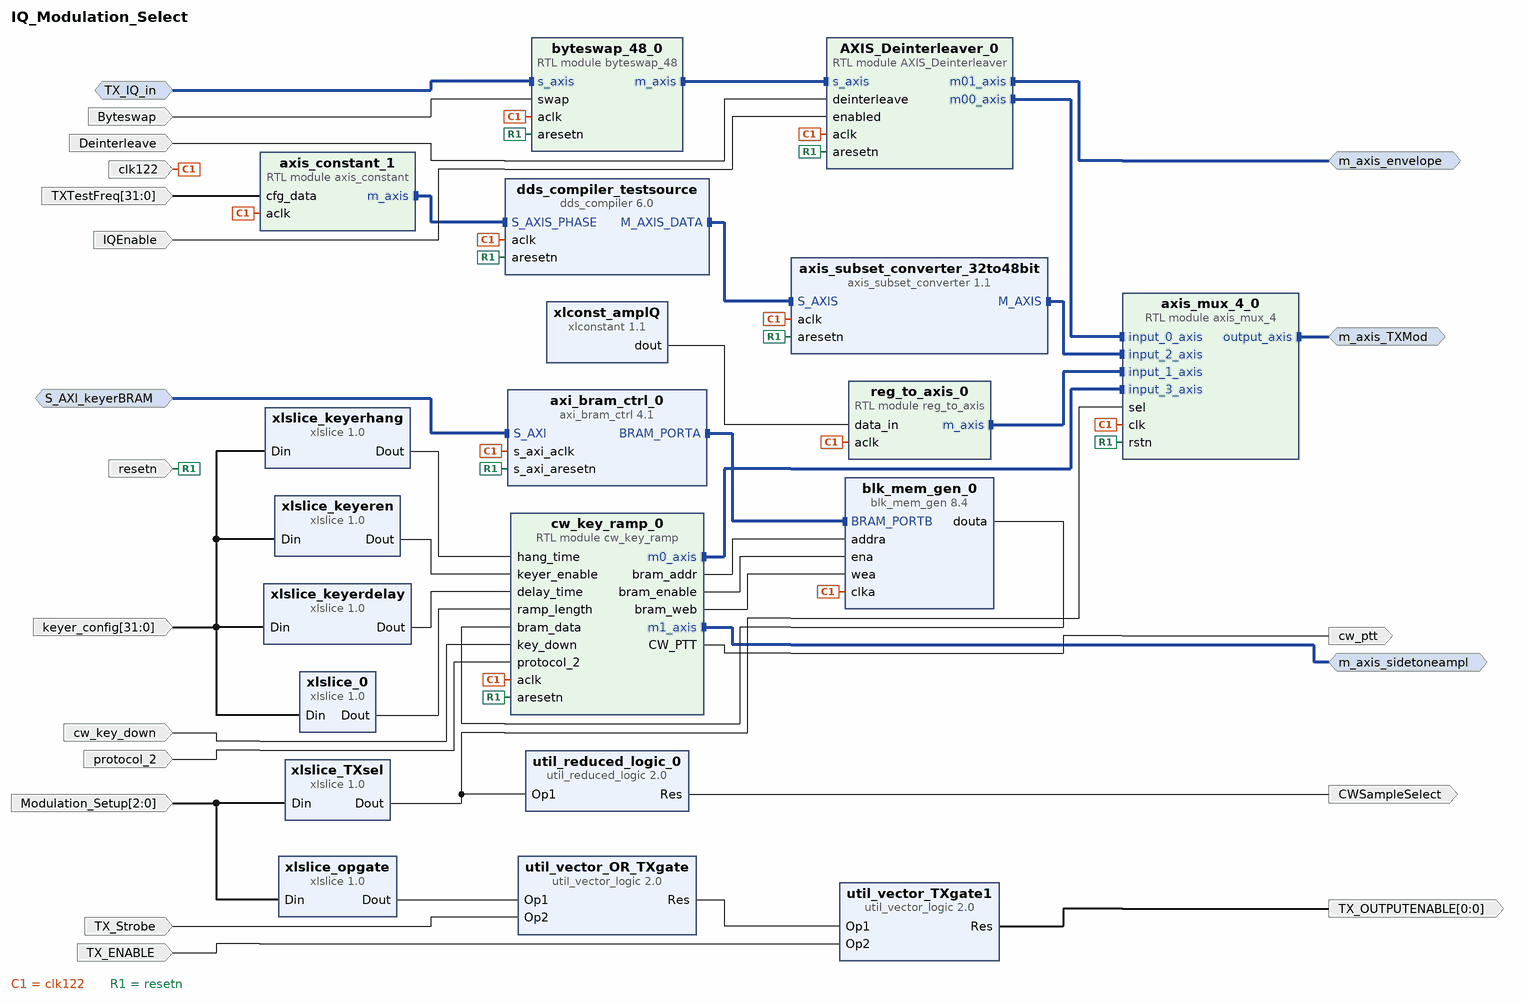
[diagram p0: block diagram of the top level]
# Vivado block design IQ_Modulation_Select, xc7a200tfbg676-2, Vivado 2021.2
create_bd_design IQ_Modulation_Select

create_bd_intf_port -mode Slave -vlnv xilinx.com:interface:aximm_rtl:1.0 S_AXI_keyerBRAM
set_property -dict [list \
  CONFIG.ADDR_WIDTH 15 \
  CONFIG.ARUSER_WIDTH 0 \
  CONFIG.AWUSER_WIDTH 0 \
  CONFIG.BUSER_WIDTH 0 \
  CONFIG.DATA_WIDTH 32 \
  CONFIG.FREQ_HZ 122880000 \
  CONFIG.HAS_BRESP 1 \
  CONFIG.HAS_BURST 1 \
  CONFIG.HAS_CACHE 1 \
  CONFIG.HAS_LOCK 1 \
  CONFIG.HAS_PROT 1 \
  CONFIG.HAS_QOS 0 \
  CONFIG.HAS_REGION 0 \
  CONFIG.HAS_RRESP 1 \
  CONFIG.HAS_WSTRB 1 \
  CONFIG.ID_WIDTH 0 \
  CONFIG.MAX_BURST_LENGTH 1 \
  CONFIG.NUM_READ_OUTSTANDING 1 \
  CONFIG.NUM_READ_THREADS 1 \
  CONFIG.NUM_WRITE_OUTSTANDING 1 \
  CONFIG.NUM_WRITE_THREADS 1 \
  CONFIG.PROTOCOL AXI4 \
  CONFIG.READ_WRITE_MODE READ_WRITE \
  CONFIG.RUSER_BITS_PER_BYTE 0 \
  CONFIG.RUSER_WIDTH 0 \
  CONFIG.SUPPORTS_NARROW_BURST 0 \
  CONFIG.WUSER_BITS_PER_BYTE 0 \
  CONFIG.WUSER_WIDTH 0 \
] [get_bd_intf_ports S_AXI_keyerBRAM]
create_bd_intf_port -mode Slave -vlnv xilinx.com:interface:axis_rtl:1.0 TX_IQ_in
set_property -dict [list \
  CONFIG.FREQ_HZ 122880000 \
  CONFIG.HAS_TKEEP 0 \
  CONFIG.HAS_TLAST 0 \
  CONFIG.HAS_TREADY 1 \
  CONFIG.HAS_TSTRB 0 \
  CONFIG.LAYERED_METADATA undef \
  CONFIG.TDATA_NUM_BYTES 6 \
  CONFIG.TDEST_WIDTH 0 \
  CONFIG.TID_WIDTH 0 \
  CONFIG.TUSER_WIDTH 0 \
] [get_bd_intf_ports TX_IQ_in]
create_bd_intf_port -mode Master -vlnv xilinx.com:interface:axis_rtl:1.0 m_axis_TXMod
set_property -dict {CONFIG.FREQ_HZ 122880000} [get_bd_intf_ports m_axis_TXMod]
create_bd_intf_port -mode Master -vlnv xilinx.com:interface:axis_rtl:1.0 m_axis_envelope
set_property -dict {CONFIG.FREQ_HZ 122880000} [get_bd_intf_ports m_axis_envelope]
create_bd_intf_port -mode Master -vlnv xilinx.com:interface:axis_rtl:1.0 m_axis_sidetoneampl
set_property -dict {CONFIG.FREQ_HZ 122880000} [get_bd_intf_ports m_axis_sidetoneampl]
create_bd_port -dir O CWSampleSelect
create_bd_port -dir I Deinterleave
create_bd_port -dir I IQEnable
create_bd_port -dir I -from 2 -to 0 Modulation_Setup
create_bd_port -dir I -from 31 -to 0 TXTestFreq
create_bd_port -dir I TX_ENABLE
create_bd_port -dir O -from 0 -to 0 TX_OUTPUTENABLE
create_bd_port -dir I TX_Strobe
create_bd_port -dir I -type clk clk122
set_property -dict [list \
  CONFIG.ASSOCIATED_BUSIF m_axis_TXMod:S_AXI_keyerBRAM:TX_IQ_in:m_axis_envelope:m_axis_sidetoneampl \
  CONFIG.FREQ_HZ 122880000 \
] [get_bd_ports clk122]
create_bd_port -dir I cw_key_down
create_bd_port -dir O cw_ptt
create_bd_port -dir I -from 31 -to 0 keyer_config
create_bd_port -dir I protocol_2
create_bd_port -dir I -type rst resetn
create_bd_port -dir I Byteswap

create_bd_cell -type ip -vlnv xilinx.com:ip:axi_bram_ctrl:4.1 axi_bram_ctrl_0
set_property -dict {CONFIG.SINGLE_PORT_BRAM 1} [get_bd_cells axi_bram_ctrl_0]
create_bd_cell -type ip -vlnv xilinx.com:ip:axis_subset_converter:1.1 axis_subset_converter_32to48bit
set_property -dict [list \
  CONFIG.M_TDATA_NUM_BYTES 6 \
  CONFIG.S_TDATA_NUM_BYTES 4 \
  CONFIG.TDATA_REMAP {tdata[31:16],8'b00000000,tdata[15:0], 8'b00000000} \
] [get_bd_cells axis_subset_converter_32to48bit]
create_bd_cell -type ip -vlnv xilinx.com:ip:blk_mem_gen:8.4 blk_mem_gen_0
set_property -dict [list \
  CONFIG.EN_SAFETY_CKT false \
  CONFIG.Enable_32bit_Address true \
  CONFIG.Enable_B Use_ENB_Pin \
  CONFIG.Memory_Type True_Dual_Port_RAM \
  CONFIG.Port_A_Write_Rate 50 \
  CONFIG.Port_B_Clock 100 \
  CONFIG.Port_B_Enable_Rate 100 \
  CONFIG.Port_B_Write_Rate 50 \
  CONFIG.Read_Width_A 32 \
  CONFIG.Read_Width_B 32 \
  CONFIG.Register_PortA_Output_of_Memory_Primitives false \
  CONFIG.Use_RSTA_Pin true \
  CONFIG.Use_RSTB_Pin true \
  CONFIG.Write_Width_A 32 \
  CONFIG.Write_Width_B 32 \
  CONFIG.use_bram_block BRAM_Controller \
] [get_bd_cells blk_mem_gen_0]
create_bd_cell -type ip -vlnv xilinx.com:ip:dds_compiler:6.0 dds_compiler_testsource
set_property -dict [list \
  CONFIG.Amplitude_Mode Full_Range \
  CONFIG.DATA_Has_TLAST Not_Required \
  CONFIG.DDS_Clock_Rate 122.88 \
  CONFIG.Frequency_Resolution 0.4 \
  CONFIG.Has_ARESETn true \
  CONFIG.Has_Phase_Out false \
  CONFIG.Has_TREADY true \
  CONFIG.Latency 13 \
  CONFIG.M_DATA_Has_TUSER Not_Required \
  CONFIG.Negative_Cosine false \
  CONFIG.Noise_Shaping None \
  CONFIG.Output_Frequency1 0 \
  CONFIG.Output_Width 16 \
  CONFIG.PINC1 0 \
  CONFIG.Parameter_Entry Hardware_Parameters \
  CONFIG.Phase_Increment Streaming \
  CONFIG.Phase_Width 32 \
  CONFIG.S_PHASE_Has_TUSER Not_Required \
  CONFIG.Spurious_Free_Dynamic_Range 45 \
] [get_bd_cells dds_compiler_testsource]
create_bd_cell -type ip -vlnv xilinx.com:ip:util_reduced_logic:2.0 util_reduced_logic_0
set_property -dict {CONFIG.C_SIZE 2} [get_bd_cells util_reduced_logic_0]
create_bd_cell -type ip -vlnv xilinx.com:ip:util_vector_logic:2.0 util_vector_OR_TXgate
set_property -dict {CONFIG.C_OPERATION or CONFIG.C_SIZE 1} [get_bd_cells util_vector_OR_TXgate]
create_bd_cell -type ip -vlnv xilinx.com:ip:util_vector_logic:2.0 util_vector_TXgate1
set_property -dict {CONFIG.C_OPERATION and CONFIG.C_SIZE 1} [get_bd_cells util_vector_TXgate1]
create_bd_cell -type ip -vlnv xilinx.com:ip:xlconstant:1.1 xlconst_amplQ
set_property -dict {CONFIG.CONST_VAL 0x00007FFFFF CONFIG.CONST_WIDTH 48} [get_bd_cells xlconst_amplQ]
create_bd_cell -type ip -vlnv xilinx.com:ip:xlslice:1.0 xlslice_0
set_property -dict {CONFIG.DIN_FROM 30 CONFIG.DIN_TO 18 CONFIG.DOUT_WIDTH 13} [get_bd_cells xlslice_0]
create_bd_cell -type ip -vlnv xilinx.com:ip:xlslice:1.0 xlslice_TXsel
set_property -dict {CONFIG.DIN_FROM 1 CONFIG.DIN_TO 0 CONFIG.DIN_WIDTH 3 CONFIG.DOUT_WIDTH 2} [get_bd_cells xlslice_TXsel]
create_bd_cell -type ip -vlnv xilinx.com:ip:xlslice:1.0 xlslice_keyerdelay
set_property -dict {CONFIG.DIN_FROM 7 CONFIG.DIN_TO 0 CONFIG.DIN_WIDTH 32 CONFIG.DOUT_WIDTH 8} [get_bd_cells xlslice_keyerdelay]
create_bd_cell -type ip -vlnv xilinx.com:ip:xlslice:1.0 xlslice_keyeren
set_property -dict {CONFIG.DIN_FROM 31 CONFIG.DIN_TO 31 CONFIG.DIN_WIDTH 32 CONFIG.DOUT_WIDTH 1} [get_bd_cells xlslice_keyeren]
create_bd_cell -type ip -vlnv xilinx.com:ip:xlslice:1.0 xlslice_keyerhang
set_property -dict {CONFIG.DIN_FROM 17 CONFIG.DIN_TO 8 CONFIG.DIN_WIDTH 32 CONFIG.DOUT_WIDTH 10} [get_bd_cells xlslice_keyerhang]
create_bd_cell -type ip -vlnv xilinx.com:ip:xlslice:1.0 xlslice_opgate
set_property -dict {CONFIG.DIN_FROM 2 CONFIG.DIN_TO 2 CONFIG.DIN_WIDTH 3 CONFIG.DOUT_WIDTH 1} [get_bd_cells xlslice_opgate]
create_bd_cell -type module -reference AXIS_Deinterleaver AXIS_Deinterleaver_0
create_bd_cell -type module -reference axis_constant axis_constant_1
set_property -dict {CONFIG.AXIS_TDATA_WIDTH 32} [get_bd_cells axis_constant_1]
create_bd_cell -type module -reference axis_mux_4 axis_mux_4_0
set_property -dict [list \
  CONFIG.CONSUME_ALL 1 \
  CONFIG.DATA_WIDTH 48 \
  CONFIG.DEST_WIDTH 0 \
  CONFIG.ID_WIDTH 0 \
  CONFIG.KEEP_ENABLE false \
  CONFIG.KEEP_WIDTH 0 \
  CONFIG.USER_ENABLE 0 \
  CONFIG.USER_WIDTH 0 \
] [get_bd_cells axis_mux_4_0]
create_bd_cell -type module -reference cw_key_ramp cw_key_ramp_0
create_bd_cell -type module -reference reg_to_axis reg_to_axis_0
set_property -dict {CONFIG.DIN_WIDTH 48} [get_bd_cells reg_to_axis_0]
create_bd_cell -type module -reference byteswap_48 byteswap_48_0

# ---- connections ----

connect_bd_intf_net [get_bd_intf_pins AXIS_Deinterleaver_0/m00_axis] [get_bd_intf_pins axis_mux_4_0/input_0_axis]
connect_bd_intf_net [get_bd_intf_ports S_AXI_keyerBRAM] [get_bd_intf_pins axi_bram_ctrl_0/S_AXI]
connect_bd_intf_net [get_bd_intf_ports m_axis_envelope] [get_bd_intf_pins AXIS_Deinterleaver_0/m01_axis]
connect_bd_intf_net [get_bd_intf_ports TX_IQ_in] [get_bd_intf_pins byteswap_48_0/s_axis]
connect_bd_intf_net [get_bd_intf_pins axi_bram_ctrl_0/BRAM_PORTA] [get_bd_intf_pins blk_mem_gen_0/BRAM_PORTB]
connect_bd_intf_net [get_bd_intf_pins axis_constant_1/m_axis] [get_bd_intf_pins dds_compiler_testsource/S_AXIS_PHASE]
connect_bd_intf_net [get_bd_intf_ports m_axis_TXMod] [get_bd_intf_pins axis_mux_4_0/output_axis]
connect_bd_intf_net [get_bd_intf_pins axis_mux_4_0/input_2_axis] [get_bd_intf_pins axis_subset_converter_32to48bit/M_AXIS]
connect_bd_intf_net [get_bd_intf_pins byteswap_48_0/m_axis] [get_bd_intf_pins AXIS_Deinterleaver_0/s_axis]
connect_bd_intf_net [get_bd_intf_pins axis_mux_4_0/input_3_axis] [get_bd_intf_pins cw_key_ramp_0/m0_axis]
connect_bd_intf_net [get_bd_intf_ports m_axis_sidetoneampl] [get_bd_intf_pins cw_key_ramp_0/m1_axis]
connect_bd_intf_net [get_bd_intf_pins axis_subset_converter_32to48bit/S_AXIS] [get_bd_intf_pins dds_compiler_testsource/M_AXIS_DATA]
connect_bd_intf_net [get_bd_intf_pins axis_mux_4_0/input_1_axis] [get_bd_intf_pins reg_to_axis_0/m_axis]
connect_bd_net [get_bd_ports Byteswap] [get_bd_pins byteswap_48_0/swap]
connect_bd_net [get_bd_ports Deinterleave] [get_bd_pins AXIS_Deinterleaver_0/deinterleave]
connect_bd_net [get_bd_ports IQEnable] [get_bd_pins AXIS_Deinterleaver_0/enabled]
connect_bd_net [get_bd_ports Modulation_Setup] [get_bd_pins xlslice_TXsel/Din] [get_bd_pins xlslice_opgate/Din]
connect_bd_net [get_bd_ports clk122] \
  [get_bd_pins axi_bram_ctrl_0/s_axi_aclk] [get_bd_pins axis_subset_converter_32to48bit/aclk] \
  [get_bd_pins blk_mem_gen_0/clka] [get_bd_pins dds_compiler_testsource/aclk] [get_bd_pins AXIS_Deinterleaver_0/aclk] \
  [get_bd_pins axis_constant_1/aclk] [get_bd_pins axis_mux_4_0/clk] [get_bd_pins cw_key_ramp_0/aclk] \
  [get_bd_pins reg_to_axis_0/aclk] [get_bd_pins byteswap_48_0/aclk]
connect_bd_net [get_bd_ports TX_ENABLE] [get_bd_pins util_vector_TXgate1/Op2]
connect_bd_net [get_bd_ports TX_Strobe] [get_bd_pins util_vector_OR_TXgate/Op2]
connect_bd_net -net TX_Test_Freq_1 [get_bd_ports TXTestFreq] [get_bd_pins axis_constant_1/cfg_data]
connect_bd_net [get_bd_pins blk_mem_gen_0/douta] [get_bd_pins cw_key_ramp_0/bram_data]
connect_bd_net [get_bd_ports cw_key_down] [get_bd_pins cw_key_ramp_0/key_down]
connect_bd_net [get_bd_pins cw_key_ramp_0/CW_PTT] [get_bd_ports cw_ptt]
connect_bd_net [get_bd_pins cw_key_ramp_0/bram_addr] [get_bd_pins blk_mem_gen_0/addra]
connect_bd_net [get_bd_pins cw_key_ramp_0/bram_enable] [get_bd_pins blk_mem_gen_0/ena]
connect_bd_net [get_bd_pins cw_key_ramp_0/bram_web] [get_bd_pins blk_mem_gen_0/wea]
connect_bd_net [get_bd_ports keyer_config] \
  [get_bd_pins xlslice_0/Din] [get_bd_pins xlslice_keyerdelay/Din] [get_bd_pins xlslice_keyeren/Din] \
  [get_bd_pins xlslice_keyerhang/Din]
connect_bd_net [get_bd_ports resetn] \
  [get_bd_pins axi_bram_ctrl_0/s_axi_aresetn] [get_bd_pins axis_subset_converter_32to48bit/aresetn] \
  [get_bd_pins dds_compiler_testsource/aresetn] [get_bd_pins AXIS_Deinterleaver_0/aresetn] [get_bd_pins axis_mux_4_0/rstn] \
  [get_bd_pins cw_key_ramp_0/aresetn] [get_bd_pins byteswap_48_0/aresetn]
connect_bd_net [get_bd_pins util_reduced_logic_0/Res] [get_bd_ports CWSampleSelect]
connect_bd_net [get_bd_pins util_vector_OR_TXgate/Res] [get_bd_pins util_vector_TXgate1/Op1]
connect_bd_net [get_bd_pins util_vector_TXgate1/Res] [get_bd_ports TX_OUTPUTENABLE]
connect_bd_net [get_bd_pins xlconst_amplQ/dout] [get_bd_pins reg_to_axis_0/data_in]
connect_bd_net [get_bd_pins xlslice_0/Dout] [get_bd_pins cw_key_ramp_0/ramp_length]
connect_bd_net [get_bd_pins xlslice_TXsel/Dout] [get_bd_pins util_reduced_logic_0/Op1] [get_bd_pins axis_mux_4_0/sel]
connect_bd_net [get_bd_pins xlslice_keyerdelay/Dout] [get_bd_pins cw_key_ramp_0/delay_time]
connect_bd_net [get_bd_pins xlslice_keyeren/Dout] [get_bd_pins cw_key_ramp_0/keyer_enable]
connect_bd_net [get_bd_pins xlslice_keyerhang/Dout] [get_bd_pins cw_key_ramp_0/hang_time]
connect_bd_net [get_bd_pins xlslice_opgate/Dout] [get_bd_pins util_vector_OR_TXgate/Op1]
connect_bd_net -net xlslice_rate_Dout [get_bd_ports protocol_2] [get_bd_pins cw_key_ramp_0/protocol_2]

# ---- address map ----
assign_bd_address -offset 0x5000 -range 4K -target_address_space [get_bd_addr_spaces S_AXI_keyerBRAM] [get_bd_addr_segs axi_bram_ctrl_0/S_AXI/Mem0]

validate_bd_design
save_bd_design
